# EAGLE design drivercontrols_adafruit_M0 (EAGLE 9.5.2)
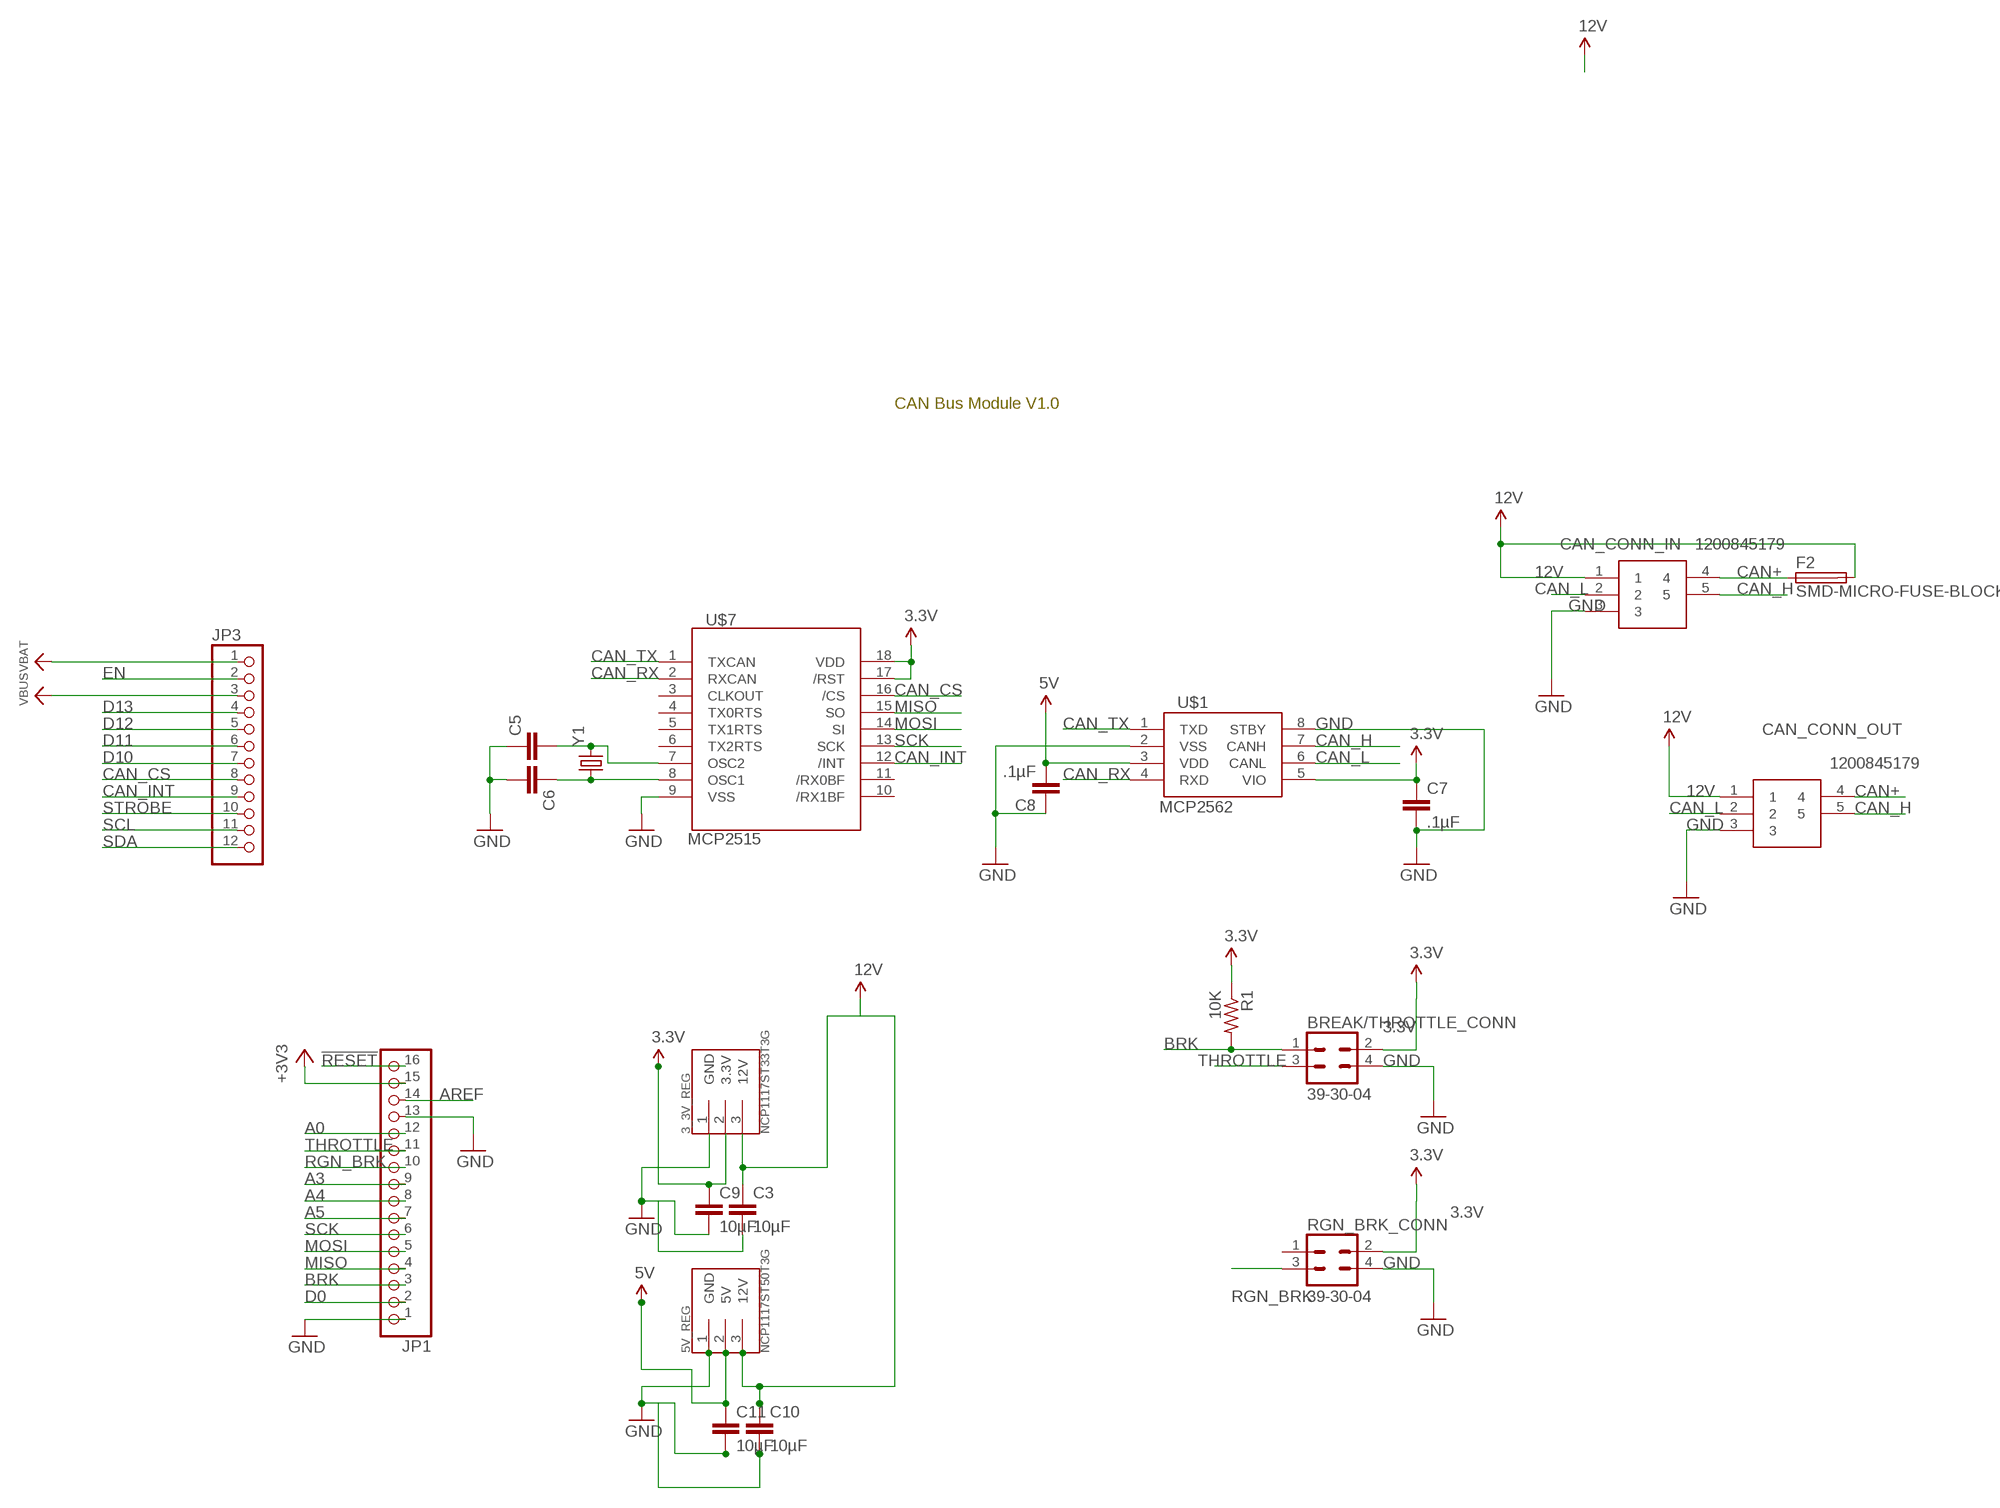
[diagram p0: schematic, sheet 1]

## Parts
3_3V_REG  NCP1117ST33T3G  [SOT223]
5V_REG  NCP1117ST50T3G  [SOT223]
BREAK/THROTTLE_CONN  39-30-04  [39-30-?04?]
C3  10µF  CAP0805  [0805]
C5  CAP0805  [0805]
C6  CAP0805  [0805]
C7  .1µF  CAP0805  [0805]
C8  .1µF  CAP0805  [0805]
C9  10µF  CAP0805  [0805]
C10  10µF  CAP0805  [0805]
C11  10µF  CAP0805  [0805]
CAN_CONN_IN  1200845179  [1200845179]
CAN_CONN_OUT  1200845179  [1200845179]
F2  SMD-MICRO-FUSE-BLOCK  [OMNIBLOK]
JP1  HEADER-1X16ROUND  [1X16_ROUND]
JP3  HEADER-1X12  [1X12_ROUND]
R1  10K  R-US_M0805  [M0805]
RGN_BRK_CONN  39-30-04  [39-30-?04?]
U$1  MCP2562  [SOIC8]
U$7  MCP2515  [SO-18W]
Y1  CRYSTALHC49US  [HC49US]

## Nets
3.3V: 3_3V_REG.2(3.3V) BREAK/THROTTLE_CONN.2 C7.1 C9.1 R1.1 RGN_BRK_CONN.2 U$1.5(VIO) U$7.17(/RST) U$7.18(VDD)
5V: 5V_REG.2(5V) C8.2 C11.1 U$1.3(VDD)
12V: 3_3V_REG.3(12V) 5V_REG.3(12V) C3.1 C10.1 CAN_CONN_IN.1 CAN_CONN_OUT.1 F2.P$2
!RESET: JP1.16
+3V3: JP1.15
A0: JP1.12
A3: JP1.9
A4: JP1.8
A5: JP1.7
AREF: JP1.14
BRK: BREAK/THROTTLE_CONN.1 JP1.3 R1.2
CAN+: CAN_CONN_IN.4 CAN_CONN_OUT.4 F2.P$1
CAN_CS: JP3.8 U$7.16(/CS)
CAN_H: CAN_CONN_IN.5 CAN_CONN_OUT.5 U$1.7(CANH)
CAN_INT: JP3.9 U$7.12(/INT)
CAN_L: CAN_CONN_IN.2 CAN_CONN_OUT.2 U$1.6(CANL)
CAN_RX: U$1.4(RXD) U$7.2(RXCAN)
CAN_TX: U$1.1(TXD) U$7.1(TXCAN)
D0: JP1.2
D10: JP3.7
D11: JP3.6
D12: JP3.5
D13: JP3.4
EN: JP3.2
GND: 3_3V_REG.1(GND) 5V_REG.1(GND) BREAK/THROTTLE_CONN.4 C3.2 C5.1 C6.2 C7.2 C8.1 C9.2 C10.2 C11.2 CAN_CONN_IN.3 CAN_CONN_OUT.3 JP1.1 JP1.13 RGN_BRK_CONN.4 U$1.2(VSS) U$1.8(STBY) U$7.9(VSS)
MISO: JP1.4 U$7.15(SO)
MOSI: JP1.5 U$7.14(SI)
N$1: C5.2 U$7.7(OSC2) Y1.2
N$11: C6.1 U$7.8(OSC1) Y1.1
RGN_BRK: JP1.10 RGN_BRK_CONN.3
SCK: JP1.6 U$7.13(SCK)
SCL: JP3.11
SDA: JP3.12
STROBE: JP3.10
THROTTLE: BREAK/THROTTLE_CONN.3 JP1.11
VBAT: JP3.1
VBUS: JP3.3
Unconnected: RGN_BRK_CONN.1 U$7.3(CLKOUT) U$7.4(TX0RTS) U$7.5(TX1RTS) U$7.6(TX2RTS) U$7.10(/RX1BF) U$7.11(/RX0BF)

## Notes on the sheet
- CAN Bus Module V1.0

## Library data of the parts
3_3V_REG = NUSOLAR_Custom:NCP1117ST33T3G
5V_REG = NUSOLAR_Custom:NCP1117ST50T3G
BREAK/THROTTLE_CONN RGN_BRK_CONN = con-molex-mini-fit:39-30-?04?: HEADER
C3 C5-C11 = SparkFun-Capacitors:CAP: Capacitor Standard 0603 ceramic capacitor, and 0.1" leaded capacitor.
CAN_CONN_IN CAN_CONN_OUT = SamacSys_Parts:1200845179: REC U12 5P AC FE M16 BM SOL SHD Source: Datasheet <https://componentsearchengine.com/Datasheets/1/1200845179.pdf>; DESCRIPTION: REC U12 5P AC FE M16 BM SOL SHD; HEIGHT: 24.8mm; MANUFACTURER_NAME: Molex; MANUFACTURER_PART_NUMBER: 1200845179; MOUSER_PART_NUMBER: 538-1200845179; MOUSER_PRICE-STOCK: https://www.mouser.com/Search/Refine.aspx?Keyword=538-1200845179
F2 = f-lf-omniblok-s:SMD-MICRO-FUSE
JP1 = microbuilder:HEADER-1X16: PIN HEADER
JP3 = microbuilder:HEADER-1X12
R1 = BeagleBone_Black_Wireless:R-US_: RESISTOR, American symbol
U$1 = NUSOLAR_Custom:MCP2562
U$7 = NUSOLAR_Custom:MCP2515
Y1 = SparkFun-FreqCtrl:CRYSTAL: Various standard crystals. Proven footprints.

## Board
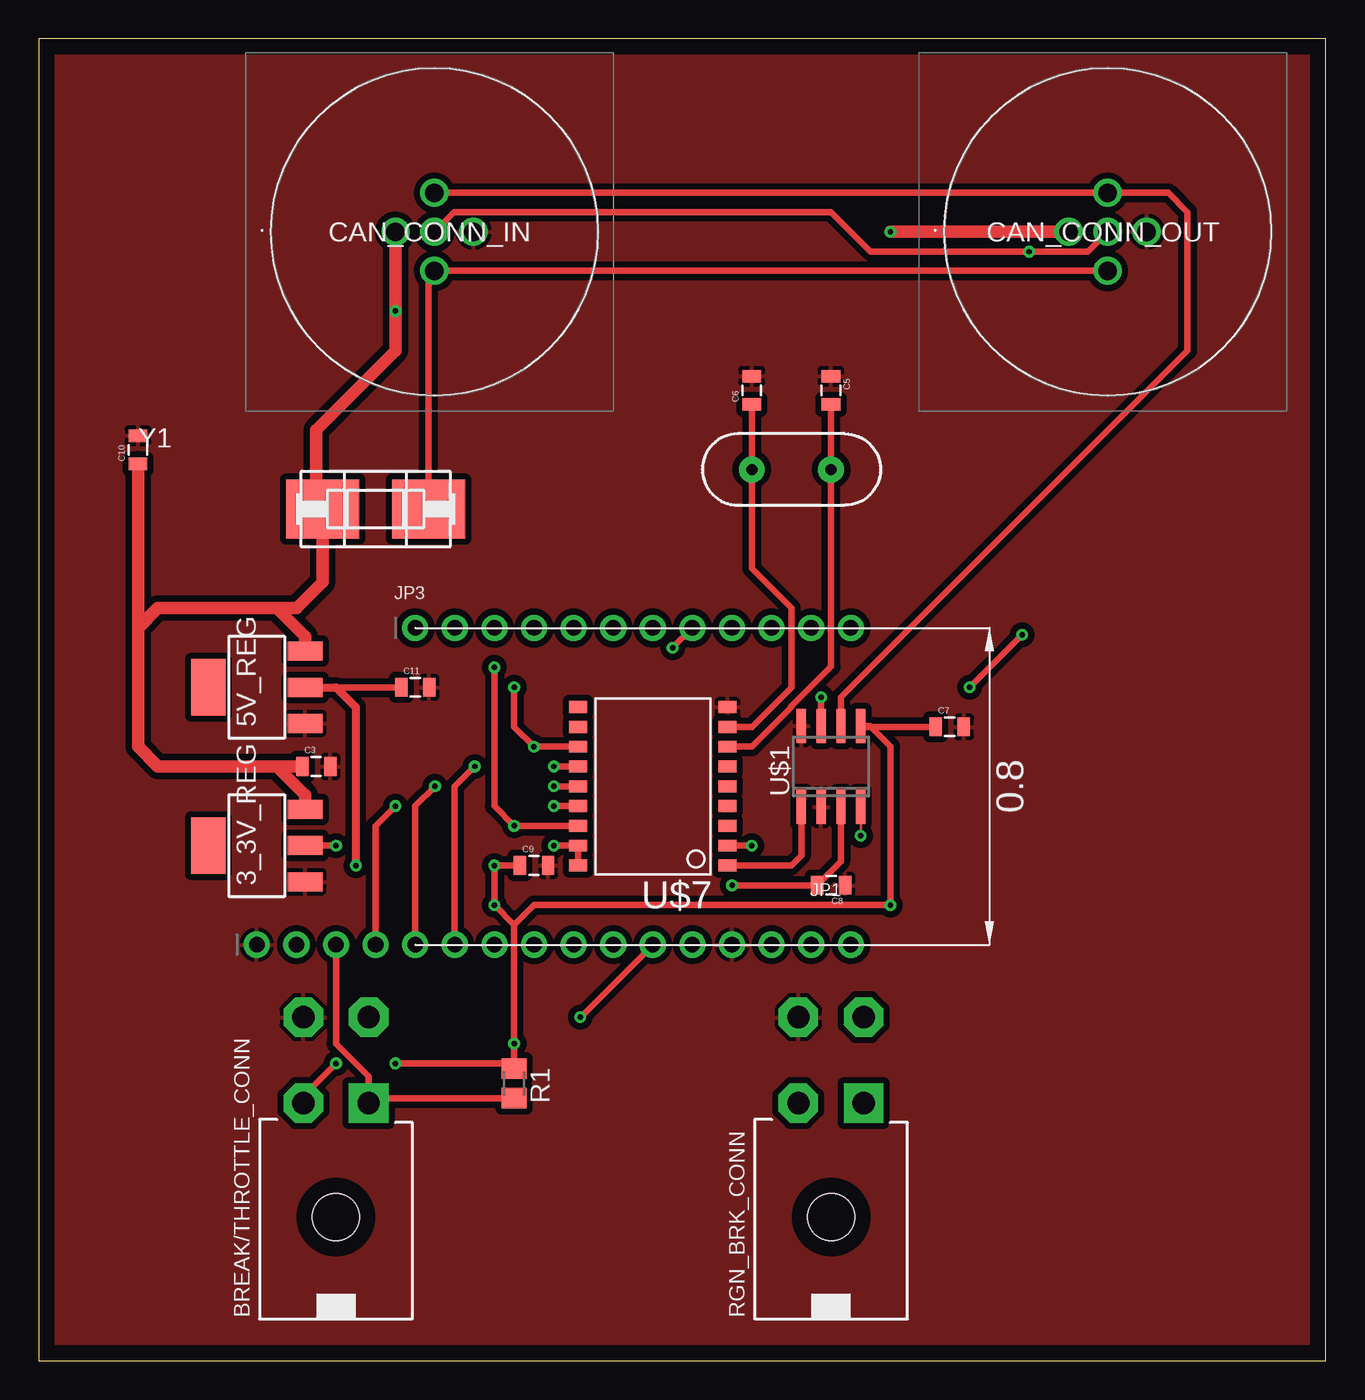
[diagram p1: board, top side]
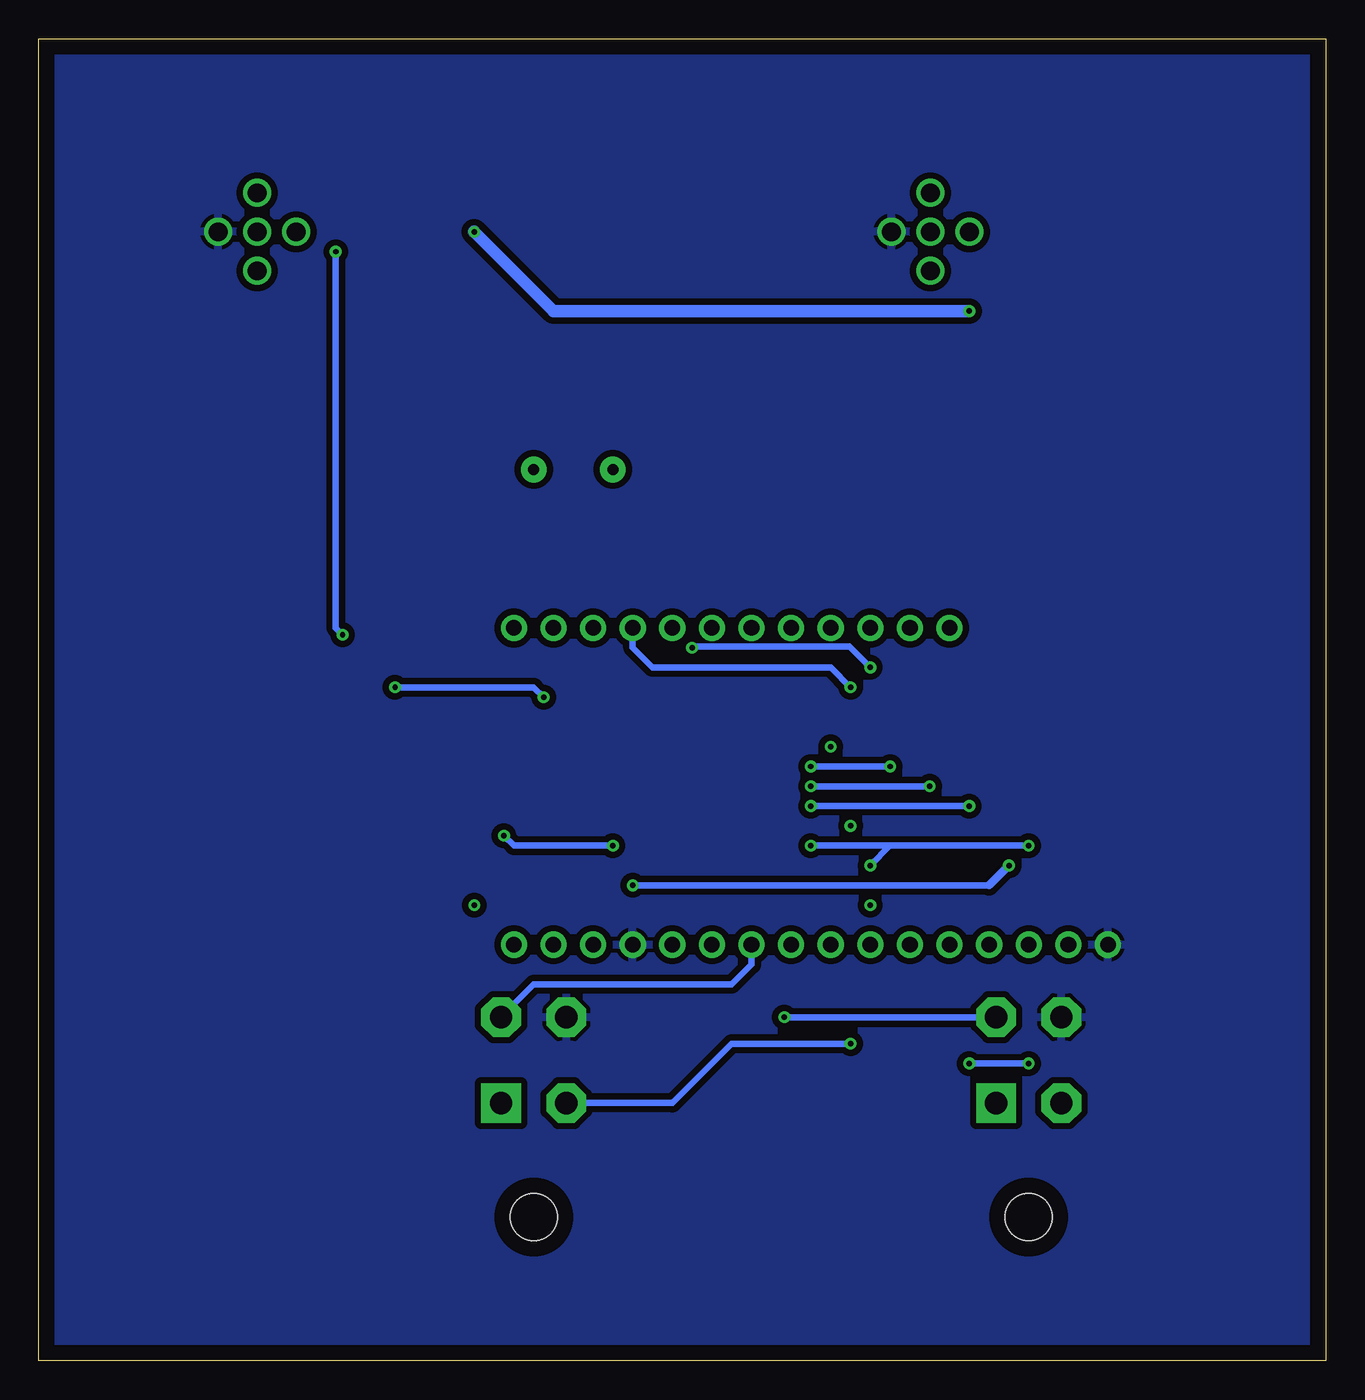
[diagram p2: board, bottom side, seen from below]

Size 82.53 x 84.76 mm. Coordinates in mm from the lower left corner, seen from the top.
Outline: 0,0 82.53,0 82.53,84.76 0,84.76 0,0
Copper layers (1*16): Top 0.035mm / dielectric 1.5mm / Bottom 0.035mm
Design rules "default": minimum track width 6mil, minimum drill 0.35mm, track to track 6mil, track to pad 6mil, pad to pad 6mil, via to via 6mil, smd to smd 6mil, copper to edge 40mil, drill to drill 6mil, minimum pad ring 10mil, minimum via ring 8mil, stop-mask expansion 4mil, vias tented up to drill 0mil, thermal gap 10mil

### Footprints (pad centres in the part's own frame; a part is rotated, then mirrored left to right if it is on the bottom)
SOT223 = smd 1.219 x 2.235: 1 -2.311,-3.099; 2 0,-3.099; 3 2.311,-3.099 | smd 3.6 x 2.2: 4 0,3.099
39-30-?04? = drill 1.422 pad 2.54 square: 1 2.095,0 | drill 1.422 pad 2.54 octagon: 2 -2.095,0; 3 2.095,5.512; 4 -2.095,5.512 | hole 3: 0,-7.3
0805 = smd 0.8 x 1.2: 1 -0.9,0; 2 0.9,0
1200845179 = drill 1.2 pad 1.8: 1 0,0; 2 2.5,2.5; 3 5,0; 4 2.5,-2.5; 5 2.5,0
OMNIBLOK = smd 4.7 x 3.8: P$1 -3.4,0; P$2 3.4,0
1X16_ROUND = drill 1 pad 1.676: 1 -19.05,0; 2 -16.51,0; 3 -13.97,0; 4 -11.43,0; 5 -8.89,0; 6 -6.35,0; 7 -3.81,0; 8 -1.27,0; 9 1.27,0; 10 3.81,0; 11 6.35,0; 12 8.89,0; 13 11.43,0; 14 13.97,0; 15 16.51,0; 16 19.05,0
1X12_ROUND = drill 1 pad 1.676: 1 -13.97,0; 2 -11.43,0; 3 -8.89,0; 4 -6.35,0; 5 -3.81,0; 6 -1.27,0; 7 1.27,0; 8 3.81,0; 9 6.35,0; 10 8.89,0; 11 11.43,0; 12 13.97,0
M0805 = smd 1.3 x 1.6: 1 -0.95,0; 2 0.95,0
SOIC8 = smd 0.6 x 2.2: 1 -1.905,-2.6; 2 -0.635,-2.6; 3 0.635,-2.6; 4 1.905,-2.6; 5 1.905,2.6; 6 0.635,2.6; 7 -0.635,2.6; 8 -1.905,2.6
SO-18W = smd 0.762 x 1.143: 1 -5.08,-4.788; 2 -3.81,-4.788; 3 -2.54,-4.788; 4 -1.27,-4.788; 5 0,-4.788; 6 1.27,-4.788; 7 2.54,-4.788; 8 3.81,-4.788; 9 5.08,-4.788; 10 5.08,4.788; 11 3.81,4.788; 12 2.54,4.788; 13 1.27,4.788; 14 0,4.788; 15 -1.27,4.788; 16 -2.54,4.788; 17 -3.81,4.788; 18 -5.08,4.788
HC49US = drill 0.7 pad 1.651: 1 -2.54,0; 2 2.54,0

### Placement (x,y rotation side)
3_3V_REG  13.97,33.02 90 top
5V_REG  13.97,43.18 90 top
BREAK/THROTTLE_CONN  39-30-04?  [39-30-?04?]  19.05,16.51 0 top
C3  17.78,38.1 0 top
C5  50.8,62.23 270 top
C6  45.72,62.23 90 top
C7  58.42,40.64 0 top
C8  50.8,30.48 180 top
C9  31.75,31.75 0 top
C10  6.35,58.42 90 top
C11  24.13,43.18 0 top
CAN_CONN_IN  22.86,72.39 0 top
CAN_CONN_OUT  66.04,72.39 0 top
F2  21.59,54.61 180 top
JP1  33.02,26.67 0 top
JP3  38.1,46.99 0 top
R1  30.48,17.78 270 top
RGN_BRK_CONN  39-30-04?  [39-30-?04?]  50.8,16.51 0 top
U$1  50.8,38.1 0 top
U$7  39.37,36.83 90 top
Y1  48.26,57.15 0 top

### Tracks (layer width: path | path; a pad name or v marks a point on that pad's centre or on a via)
3.3V  (via drill 0.35)
  Top 0.152: U$1.5 52.77,40.64
  Top 0.406: C7.1 52.77,40.64 | U$1.5 53.28,40.7 54.61,39.37 v54.61,29.21 31.75,29.21 30.48,27.94 | v33.02,33.02 U$7.17 U$7.18 | v19.05,19.05 16.95,16.95 BREAK/THROTTLE_CONN.2 | v19.05,33.02 3_3V_REG.2 | 30.48,27.94 v29.21,29.21 v29.21,31.75 C9.1 | 30.48,27.94 v30.48,20.32 R1.1 30.16,19.05 v22.86,19.05
  Bottom 0.406: v29.21,31.75 27.94,33.02 | v30.48,20.32 38.1,20.32 41.91,16.51 RGN_BRK_CONN.2 | v33.02,33.02 27.94,33.02 | v22.86,19.05 v19.05,19.05 | 27.94,33.02 v19.05,33.02
5V  (via drill 0.35)
  Top 0.406: U$1.3 51.44,32.02 C8.2 v44.45,30.48 | 19.05,43.18 C11.1
  Top 0.508: v20.32,31.75 20.32,41.91 19.05,43.18 5V_REG.2
  Bottom 0.406: 21.59,30.48 v44.45,30.48
  Bottom 0.508: v20.32,31.75 21.59,30.48
12V  (via drill 0.35)
  Top 0.152: F2.P$2 17.78,55.02
  Top 0.813: 3_3V_REG.3 17.07,36.27 15.24,38.1 | 6.35,46.99 7.62,48.26 15.24,48.26 | 5V_REG.3 17.07,46.43 15.24,48.26 | 6.35,46.99 C10.1 | 15.24,48.26 16.51,48.26 18.19,49.94 F2.P$2 | CAN_CONN_IN.1 v22.86,67.31 22.86,64.77 17.78,59.69 17.78,55.02 | 15.24,38.1 7.62,38.1 6.35,39.37 6.35,46.99 | CAN_CONN_OUT.1 v54.61,72.39 | 15.24,38.1 C3.1
  Bottom 0.813: v54.61,72.39 49.53,67.31 v22.86,67.31
BRK
  Top 0.406: JP1.3 19.05,20.32 21.14,18.23 BREAK/THROTTLE_CONN.1 21.47,16.83 R1.2
CAN+
  Top 0.406: F2.P$1 24.99,69.52 CAN_CONN_IN.4 CAN_CONN_OUT.4
CAN_CS  (via drill 0.35)
  Top 0.406: v29.21,44.45 29.21,35.56 v30.48,34.29 U$7.16 | v40.64,45.72 JP3.8
  Bottom 0.406: v29.21,44.45 30.56,45.8 40.56,45.8 v40.64,45.72
CAN_H  (via drill 0.35)
  Top 0.406: U$1.7 v50.17,42.55 | v59.69,43.18 v63.06,46.55 | CAN_CONN_OUT.5 67.27,71.12 v63.5,71.12 53.34,71.12 50.8,73.66 26.63,73.66 CAN_CONN_IN.5
  Bottom 0.406: v50.17,42.55 50.8,43.18 v59.69,43.18 | v63.5,71.12 63.5,46.99 v63.06,46.55
CAN_INT  (via drill 0.35)
  Top 0.406: v30.48,43.18 30.48,40.64 v31.75,39.37 U$7.12
  Bottom 0.406: v30.48,43.18 31.75,44.45 43.18,44.45 44.45,45.72 JP3.9
CAN_L
  Top 0.406: U$1.6 51.44,42.55 73.66,64.77 73.66,73.66 72.43,74.89 CAN_CONN_OUT.2 CAN_CONN_IN.2
CAN_RX  (via drill 0.35)
  Top 0.152: U$1.4 v52.7,33.66
  Top 0.406: U$7.2 v45.72,33.02
  Bottom 0.406: v45.72,33.02 52.07,33.02 v52.7,33.66
CAN_TX
  Top 0.406: U$7.1 48.26,31.75 48.89,32.38 U$1.1
GND
  pour Top (isolate 0.406): 0,85.09 0,0 82.55,0 82.55,85.09
  pour Bottom (isolate 0.406): 0,85.09 0,0 82.55,0 82.55,85.09
MISO  (via drill 0.35)
  Top 0.406: JP1.4 21.59,34.29 v22.86,35.56 | v33.02,35.56 U$7.15
  Bottom 0.406: v22.86,35.56 v33.02,35.56
MOSI  (via drill 0.35)
  Top 0.406: JP1.5 24.13,35.56 v25.4,36.83 | v33.02,36.83 U$7.14
  Bottom 0.406: v25.4,36.83 v33.02,36.83
N$1
  Top 0.152: U$7.7 44.45,39.37
  Top 0.406: C5.2 Y1.2 50.8,44.51 48.24,41.95 48.24,41.89 45.72,39.37 44.45,39.37
N$11
  Top 0.406: C6.1 Y1.1 45.72,50.8 48.26,48.26 48.26,43.18 45.72,40.64 U$7.8
RGN_BRK
  Bottom 0.406: JP1.10 36.83,25.4 38.1,24.13 50.8,24.13 52.89,22.03 RGN_BRK_CONN.3
SCK  (via drill 0.35)
  Top 0.406: v27.94,38.1 26.67,36.83 JP1.6 | v33.02,38.1 U$7.13
  Bottom 0.406: v27.94,38.1 v33.02,38.1
THROTTLE  (via drill 0.35)
  Top 0.406: JP1.11 v34.72,22.02
  Bottom 0.406: v34.72,22.02 BREAK/THROTTLE_CONN.3